# EAGLE schematic ADUM1250ARZ v.01 (EAGLE 6.4)
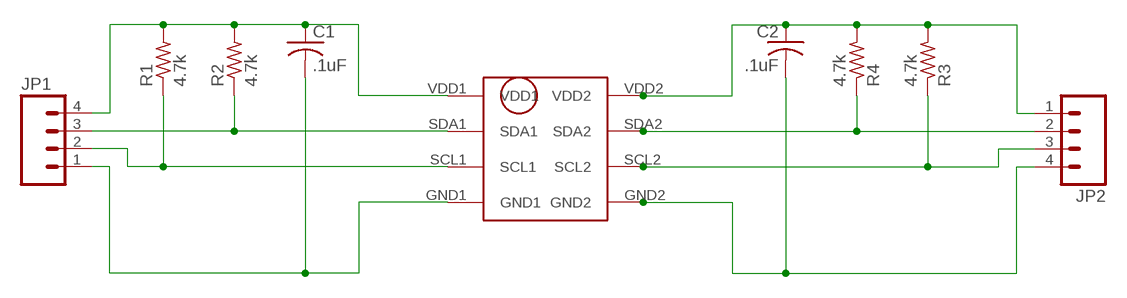
[diagram p0: schematic, sheet 1]

## Parts
C1  .1uF  C-USC0805  [C0805]
C2  .1uF  C-USC0805  [C0805]
JP1  M04PTH  [1X04]
JP2  M04PTH  [1X04]
R1  4.7k  R-US_R0805  [R0805]
R2  4.7k  R-US_R0805  [R0805]
R3  4.7k  R-US_R0805  [R0805]
R4  4.7k  R-US_R0805  [R0805]
U$1  ADUM1250ARZ  [ADUM1250ARZ]

## Nets
GND1: C1.2 JP1.1 U$1.GND1
GND2: C2.2 JP2.4 U$1.GND2
SCL1: JP1.2 R1.1 U$1.SCL1
SCL2: JP2.3 R3.1 U$1.SCL2
SDA1: JP1.3 R2.1 U$1.SDA1
SDA2: JP2.2 R4.1 U$1.SDA2
VDD1: C1.1 JP1.4 R1.2 R2.2 U$1.VDD1
VDD2: C2.1 JP2.1 R3.2 R4.2 U$1.VDD2

## Library data of the parts
C1 C2 = resistor:C-US: CAPACITOR, American symbol
JP1 JP2 = SparkFun:M04: Header 4 Standard 4-pin 0.1" header. Use with straight break away headers (SKU : PRT-00116), right angle break away headers (PRT-00553), swiss pins (PRT-00743), machine pins (PRT-00117), and female headers (PRT-00115). Molex polarized connector foot print use with SKU : PRT-08231 with associated crimp pins and housings. 1MM SMD Version SKU: PRT-10208
R1-R4 = resistor:R-US_: RESISTOR, American symbol
U$1 = Random parts:ADUM1250ARZ